# Altium schematic sheet BLOCK_DIAGRAM.SchDoc
size A4; SheetNumber: 2; SheetTotal: 8
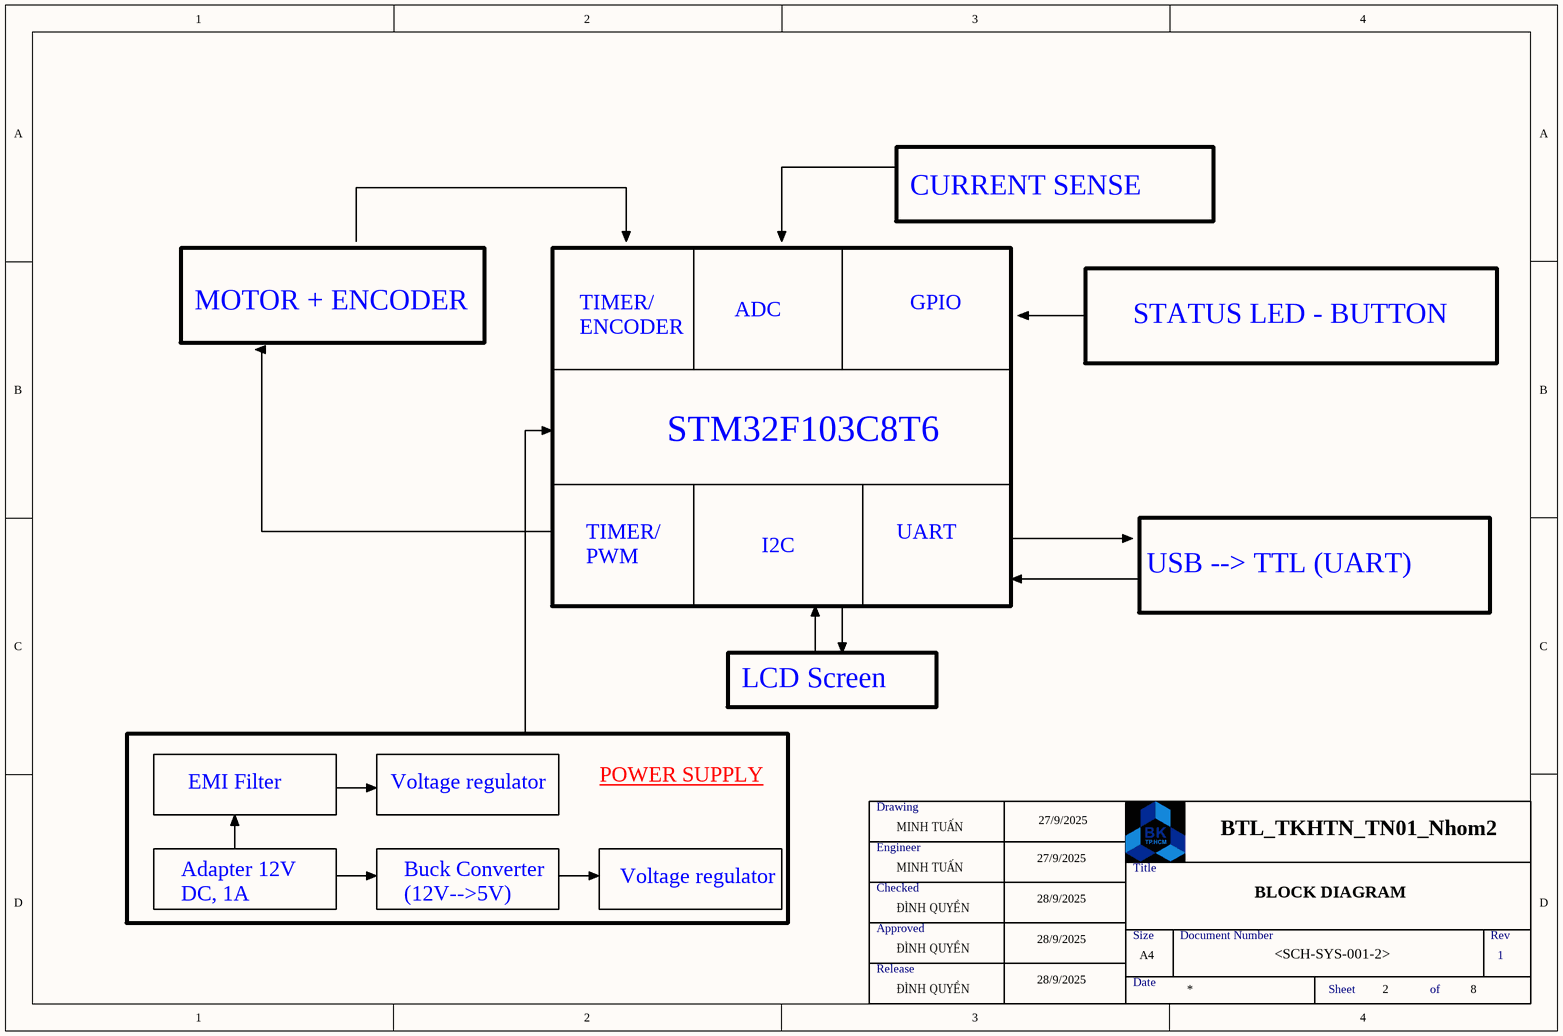
[diagram p0: BLOCK_DIAGRAM.SchDoc]

## Notes on the sheet
- CURRENT SENSE
- MOTOR + ENCODER
- TIMER/
  ENCODER
- GPIO
- STM32F103C8T6
- ADC
- STATUS LED - BUTTON
- TIMER/
  PWM
- I2C
- UART
- USB --> TTL (UART)
- LCD Screen
- POWER SUPPLY
- Voltage regulator
- Drawing
- Engineer
- MINH TUẤN
- 27/9/2025
- BTL_TKHTN_TN01_Nhom2
- Adapter 12V DC, 1A
- EMI Filter
- Buck Converter (12V-->5V)
- Checked
- ĐÌNH QUYỀN
- 28/9/2025
- Title
- BLOCK DIAGRAM
- Approved
- Release
- Size
- Date
- A4
- Document Number
- <SCH-SYS-001-2>
- Rev
- 1
- Sheet
- 2
- of
- 8